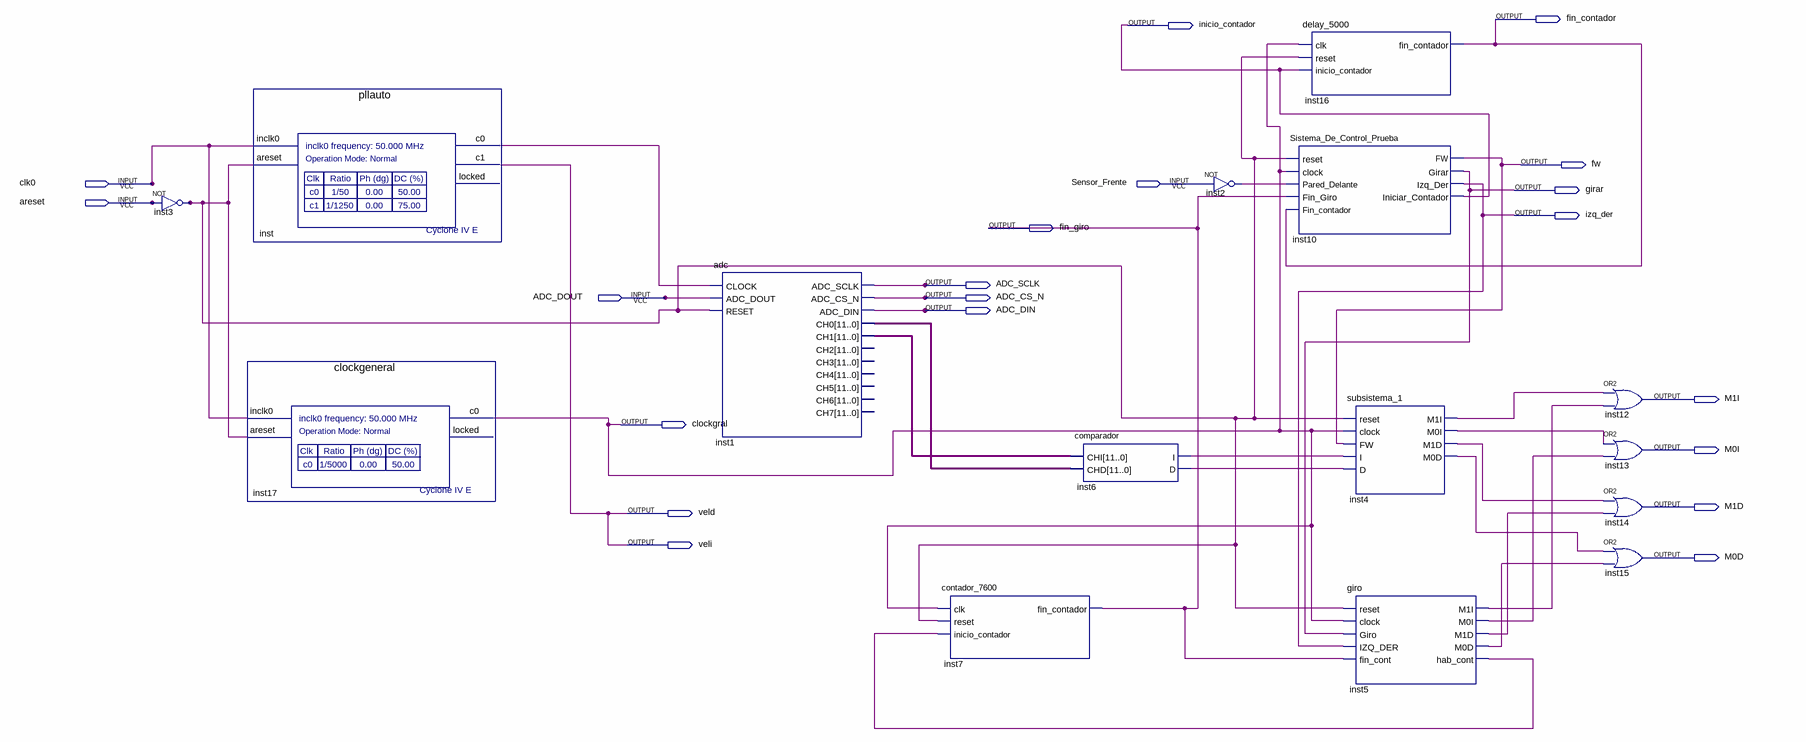
[diagram p0: schematic sheet]
// Quartus schematic Main_Esquematico con delay.bdf as structural Verilog: 15 symbols, 20 pins
module \Main_Esquematico_con_delay  (
  input  clk0,
  input  Sensor_Frente,
  input  areset,
  input  ADC_DOUT,
  output fin_contador,
  output inicio_contador,
  output fw,
  output girar,
  output izq_der,
  output fin_giro,
  output ADC_SCLK,
  output ADC_CS_N,
  output ADC_DIN,
  output M1I,
  output clockgral,
  output M0I,
  output M1D,
  output veld,
  output veli,
  output M0D
);

  wire inst2_out, inst3_out, inst4_m0d, inst4_m0i, inst4_m1d, inst4_m1i, inst5_hab_cont, inst5_m0d,
       inst5_m0i, inst5_m1d, inst5_m1i, inst6_d, inst6_i, inst_c0;
  wire [11:0] inst1_ch0, inst1_ch1;

  not inst3 (inst3_out, areset);
  pllauto inst (.inclk0(clk0), .areset(inst3_out), .c0(inst_c0), .c1(veld));  // open: locked
  clockgeneral inst17 (.inclk0(clk0), .areset(inst3_out), .c0(clockgral));  // open: locked
  adc inst1 (
    .CLOCK(inst_c0), .ADC_DOUT(ADC_DOUT), .RESET(inst3_out), .ADC_SCLK(ADC_SCLK), .ADC_CS_N(ADC_CS_N),
    .ADC_DIN(ADC_DIN), .CH0(inst1_ch0), .CH1(inst1_ch1));  // open: CH2, CH3, CH4, CH5, CH6, CH7
  contador_7600 inst7 (.clk(clockgral), .reset(inst3_out), .inicio_contador(inst5_hab_cont), .fin_contador(fin_giro));
  comparador inst6 (.CHI(inst1_ch1), .CHD(inst1_ch0), .I(inst6_i), .D(inst6_d));
  not inst2 (inst2_out, Sensor_Frente);
  delay_5000 inst16 (
    .clk(clockgral), .reset(inst3_out), .inicio_contador(inicio_contador), .fin_contador(fin_contador));
  Sistema_De_Control_Prueba inst10 (
    .reset(inst3_out), .clock(clockgral), .Pared_Delante(inst2_out), .Fin_Giro(fin_giro),
    .Fin_contador(fin_contador), .FW(fw), .Girar(girar), .Izq_Der(izq_der), .Iniciar_Contador(inicio_contador));
  subsistema_1 inst4 (
    .reset(inst3_out), .clock(clockgral), .FW(fw), .I(inst6_i), .D(inst6_d), .M1I(inst4_m1i),
    .M0I(inst4_m0i), .M1D(inst4_m1d), .M0D(inst4_m0d));
  giro inst5 (
    .reset(inst3_out), .clock(clockgral), .Giro(girar), .IZQ_DER(izq_der), .fin_cont(fin_giro),
    .M1I(inst5_m1i), .M0I(inst5_m0i), .M1D(inst5_m1d), .M0D(inst5_m0d), .hab_cont(inst5_hab_cont));
  or inst12 (M1I, inst4_m1i, inst5_m1i);
  or inst13 (M0I, inst4_m0i, inst5_m0i);
  or inst14 (M1D, inst4_m1d, inst5_m1d);
  or inst15 (M0D, inst4_m0d, inst5_m0d);

  assign veli = veld;
endmodule
